# Altium schematic sheet S7CAS-PLEIADES-CARTE-MERE_P20_Motor.SchDoc
size Tabloid; SheetNumber: 19; SheetTotal: 20; Sheet_Name: Motor; Size: 11x17
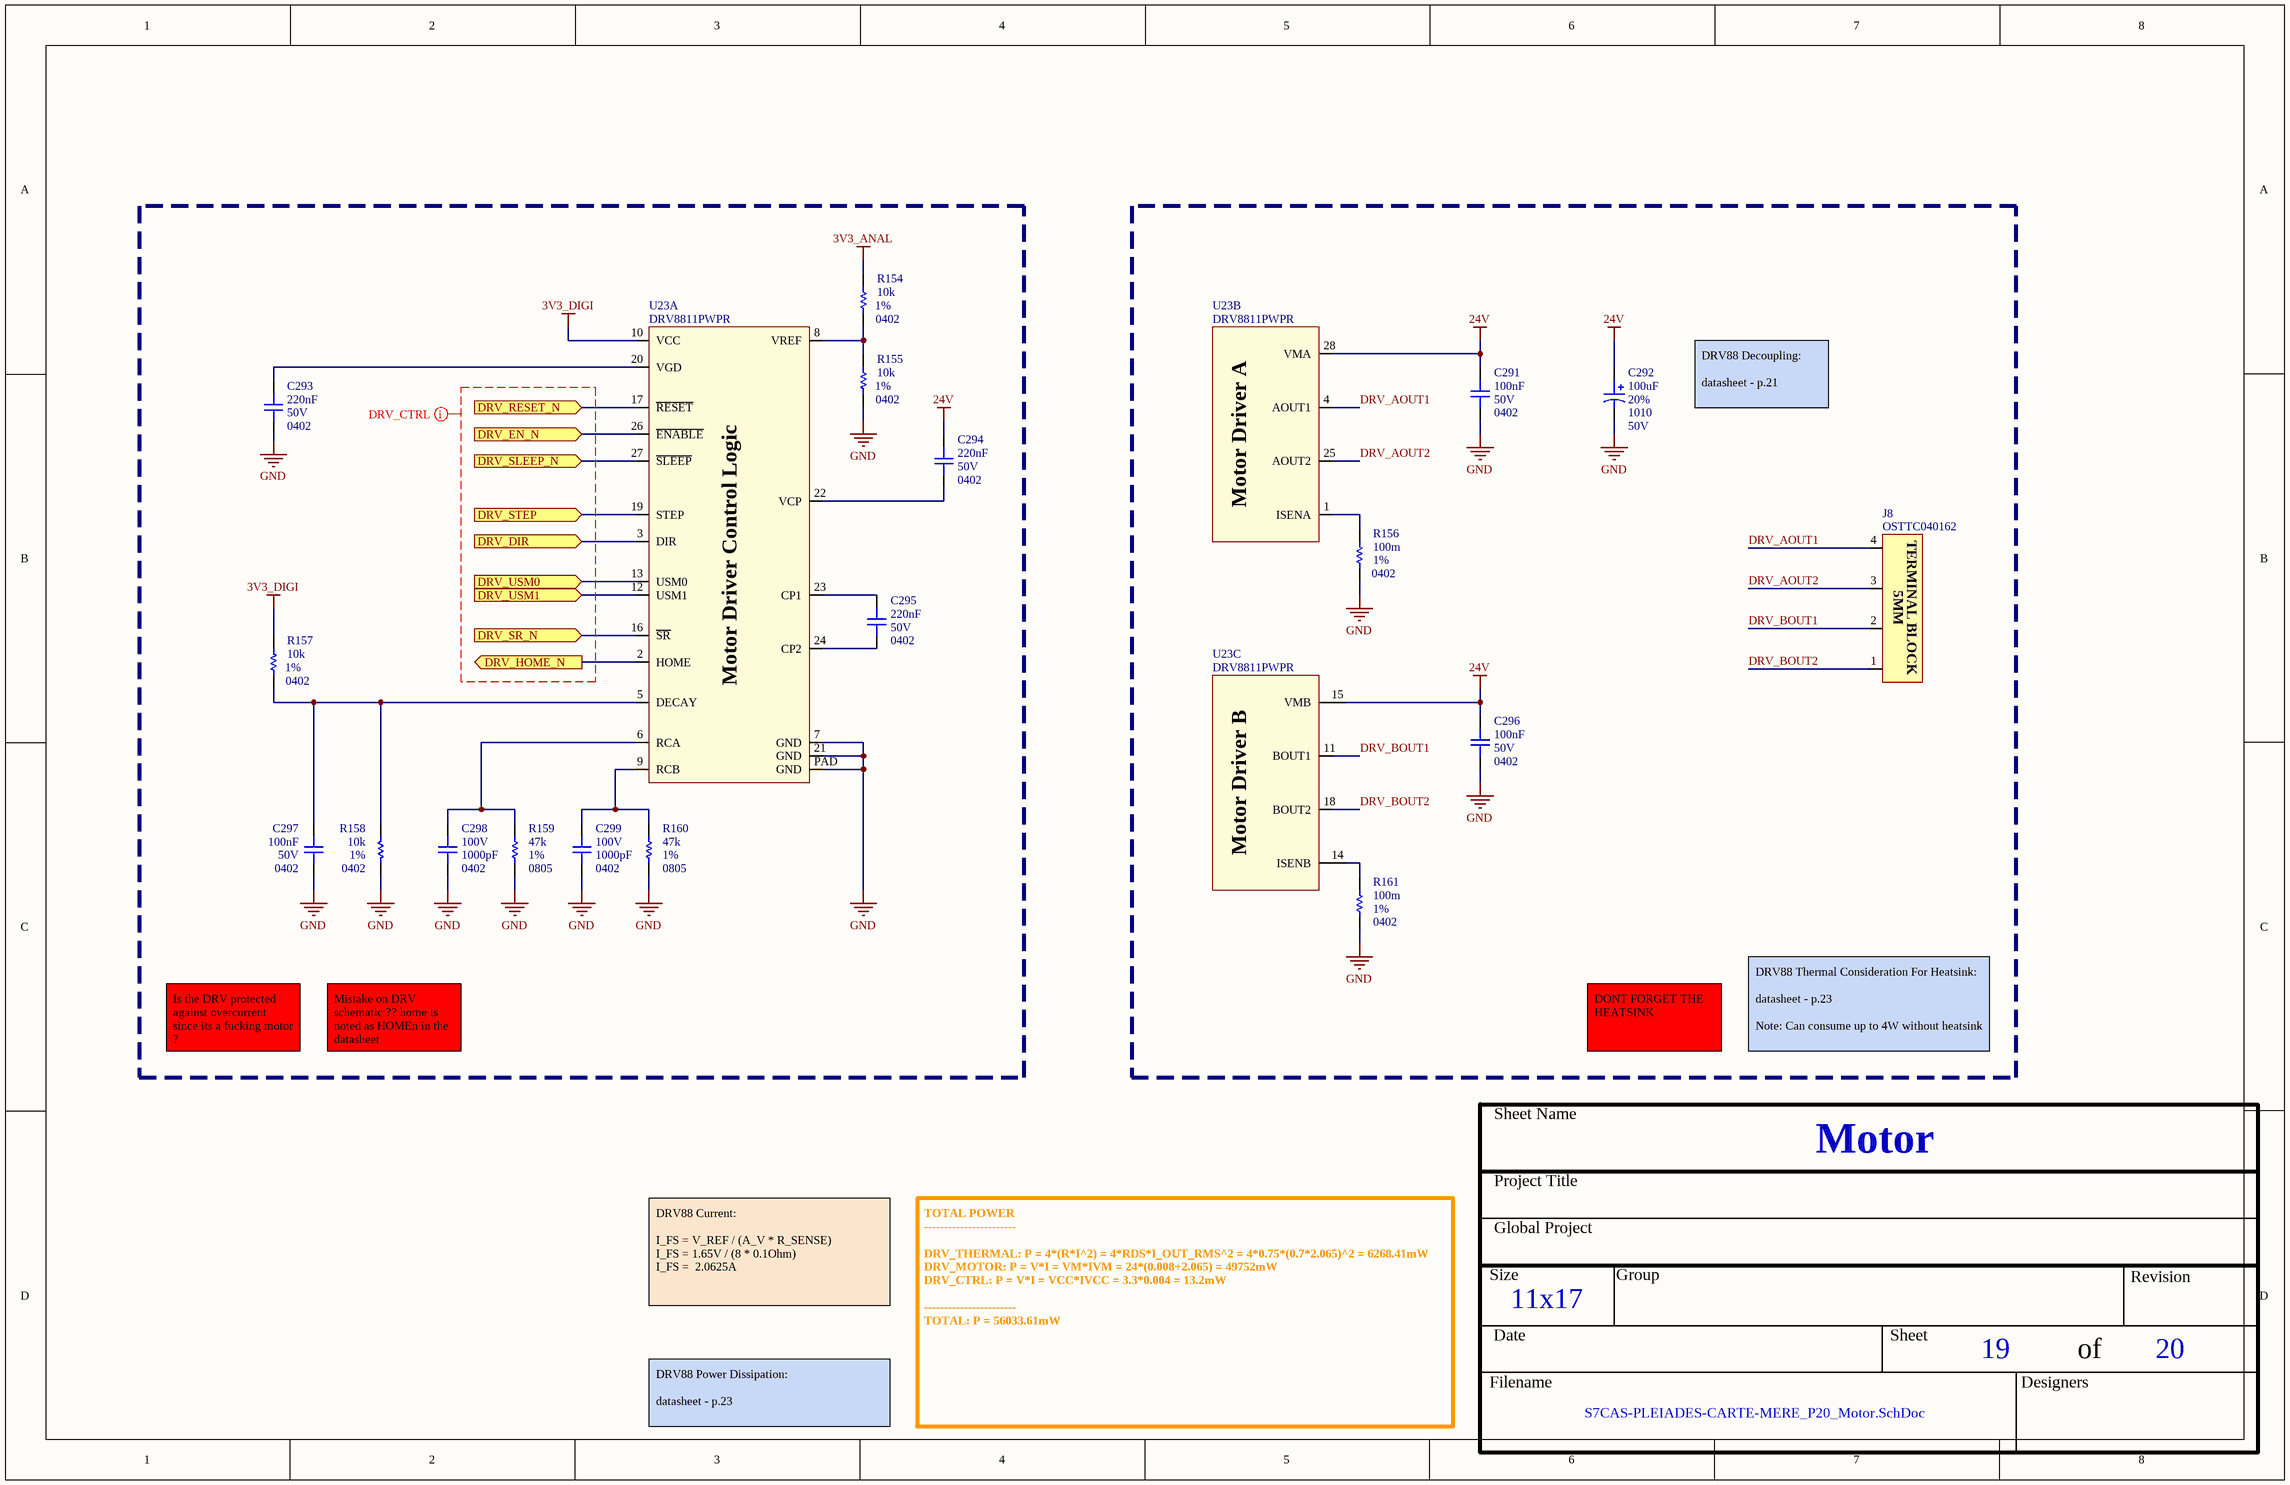
[diagram p0: S7CAS-PLEIADES-CARTE-MERE_P20_Motor.SchDoc]

## Parts
C291  value 100nF  Voltage: 50V  Package: 0402  [CAP_0402]  (hidden comment: CAP - 0402)
C292  value 100uF  Voltage: 50V  Package: 1010  Precision: 20%  [CAP_ALU_1010_vishay]  (hidden comment: MAL215099101E3)
C293  value 220nF  Voltage: 50V  Package: 0402  [CAP_0402]  (hidden comment: CAP - 0402)
C294  value 220nF  Voltage: 50V  Package: 0402  [CAP_0402]  (hidden comment: CAP - 0402)
C295  value 220nF  Voltage: 50V  Package: 0402  [CAP_0402]  (hidden comment: CAP - 0402)
C296  value 100nF  Voltage: 50V  Package: 0402  [CAP_0402]  (hidden comment: CAP - 0402)
C297  value 100nF  Voltage: 50V  Package: 0402  [CAP_0402]  (hidden comment: CAP - 0402)
C298  value 1000pF  Voltage: 100V  Package: 0402  [CAP_0402]  (hidden comment: CAP - 0402)
C299  value 1000pF  Voltage: 100V  Package: 0402  [CAP_0402]  (hidden comment: CAP - 0402)
J8  OSTTC040162  [CONN_TERMINAL_OSTTA040161]
R154  value 10k  Package: 0402  Precision: 1%  [RES_0402]  (hidden comment: RES - 0402)
R155  value 10k  Package: 0402  Precision: 1%  [RES_0402]  (hidden comment: RES - 0402)
R156  value 100m  Package: 0402  Precision: 1%  [RES_0402]  (hidden comment: RES - 0402)
R157  value 10k  Package: 0402  Precision: 1%  [RES_0402]  (hidden comment: RES - 0402)
R158  value 10k  Package: 0402  Precision: 1%  [RES_0402]  (hidden comment: RES - 0402)
R159  value 47k  Package: 0805  Precision: 1%  [RES_0402]  (hidden comment: RES - 0402)
R160  value 47k  Package: 0805  Precision: 1%  [RES_0402]  (hidden comment: RES - 0402)
R161  value 100m  Package: 0402  Precision: 1%  [RES_0402]  (hidden comment: RES - 0402)
U23  DRV8811PWPR  [POW_MOTOR_DRV8811PWPR]  (parts A,B,C of 3)

## Ports
DRV_DIR (in), DRV_EN_N (in), DRV_HOME_N (out), DRV_RESET_N (in), DRV_SLEEP_N (in), DRV_SR_N (in), DRV_STEP (in), DRV_USM0 (in), DRV_USM1 (in)

## Nets
3V3_ANAL: R154.2
3V3_DIGI: R157.2 U23.10(VCC)
24V: C291.2 C292.1 C294.2 C296.2 U23.15(VMB) U23.28(VMA)
GND: C291.1 C292.2 C293.1 C296.1 C297.1 C298.2 C299.2 R155.1 R156.1 R158.1 R159.1 R160.1 R161.1 U23.7(GND) U23.21(GND) U23.PAD(GND)
DRV_AOUT1: J8.4 U23.4(AOUT1)
DRV_AOUT2: J8.3 U23.25(AOUT2)
DRV_BOUT1: J8.2 U23.11(BOUT1)
DRV_BOUT2: J8.1 U23.18(BOUT2)
DRV_DIR: U23.3(DIR) ; port DRV_DIR
DRV_EN_N: U23.26(~{ENABLE}) ; port DRV_EN_N
DRV_HOME_N: U23.2(HOME) ; port DRV_HOME_N
DRV_RESET_N: U23.17(~{RESET}) ; port DRV_RESET_N
DRV_SLEEP_N: U23.27(~{SLEEP}) ; port DRV_SLEEP_N
DRV_SR_N: U23.16(~{SR}) ; port DRV_SR_N
DRV_STEP: U23.19(STEP) ; port DRV_STEP
DRV_USM0: U23.13(USM0) ; port DRV_USM0
DRV_USM1: U23.12(USM1) ; port DRV_USM1
NetC293_2: C293.2 U23.20(VGD)
NetC294_1: C294.1 U23.22(VCP)
NetC295_1: C295.1 U23.24(CP2)
NetC295_2: C295.2 U23.23(CP1)
NetC297_2: C297.2 R157.1 R158.2 U23.5(DECAY)
NetC298_1: C298.1 R159.2 U23.6(RCA)
NetC299_1: C299.1 R160.2 U23.9(RCB)
NetR154_1: R154.1 R155.2 U23.8(VREF)
NetR156_2: R156.2 U23.1(ISENA)
NetR161_2: R161.2 U23.14(ISENB)

## Layout directives
net class TRACKS_50: (no net found under the mark)

## Notes on the sheet
- DRV88 Decoupling:
  datasheet - p.21
- Is the DRV protected against overcurrent since its a fucking motor ?
- Mistake on DRV schematic ?? home is noted as HOMEn in the datasheet
- DONT FORGET THE HEATSINK
- DRV88 Thermal Consideration For Heatsink:
  datasheet - p.23
  Note: Can consume up to 4W without heatsink
- DRV88 Current:
  I_FS = V_REF / (A_V * R_SENSE)
  I_FS = 1.65V / (8 * 0.1Ohm)
  I_FS =  2.0625A
- DRV88 Power Dissipation:
  datasheet - p.23
- TOTAL POWER
  -----------------------
  DRV_THERMAL: P = 4*(R*I^2) = 4*RDS*I_OUT_RMS^2 = 4*0.75*(0.7*2.065)^2 = 6268.41mW
  DRV_MOTOR: P = V*I = VM*IVM = 24*(0.008+2.065) = 49752mW
  DRV_CTRL: P = V*I = VCC*IVCC = 3.3*0.004 = 13.2mW
  -----------------------
  TOTAL: P = 56033.61mW
- Sheet Name
- Project Title
- Global Project
- Size
- Group
- Revision
- Date
- Sheet
- of
- Filename
- Designers
- (in symbol CONN_TERMINAL_OSTTC040162) 5MM; TERMINAL BLOCK
- (in symbol POW_MOTOR_DRV8811PWPR, part A) Motor Driver Control Logic
- (in symbol POW_MOTOR_DRV8811PWPR, part B) Motor Driver A
- (in symbol POW_MOTOR_DRV8811PWPR, part C) Motor Driver B

## Library data of the parts
C291 C296 C297 = CAP - 0402: Mfg Part Number: GRM155R61H104KE14; Precision: 10%; Current: *; CreatedBy: Jonathan Bouchard; Power: *
C292 = CAP_ALU_MAL215099101E3: CAP - ALU 100uF 20% 50V - 1010; Current: 490mA; Mfg: Vishay Dale; Mfg Part Number: MAL215099101E3; HelpURL: http://www.vishay.com/docs/28395/150crz.pdf; CreatedBy: Jonathan Bouchard; Temperature: -55°C to 125°C; Power: *; Supplier 1: Digikey; Supplier Part Number 1: 4399PHDKR-ND
C293-C295 = CAP - 0402: Mfg Part Number: GRM155R61H224KE01; Precision: 10%; Current: *; CreatedBy: Jonathan Bouchard; Power: *
C298 C299 = CAP - 0402: Mfg Part Number: GRM155R72A102KA01; Precision: 10%; Current: *; CreatedBy: Jonathan Bouchard; Power: *
J8 = CONN_TERMINAL_OSTTC040162: CONN -  TERMINAL BLOCK 4POS 5MM - TH; Mfg: On Shore Technology Inc.; Voltage: *; Current: *; Power: *; Mfg Part Number: OSTTC040162; HelpURL: http://www.on-shore.com/wp-content/uploads/2015/09/osttcxx0162.pdf; CreatedBy: Jonathan Bouchard; Temperature: -30°C ~ 105°C; Value: *; Precision: *; Package: TH-4; Supplier 1: Digikey; Supplier Part Number 1: ED2602-ND
R154 R155 R157 R158 = RES - 0402: Mfg Part Number: MCS04020C1002FE000; Voltage: 50V; Power: 1/2W; Current: *; CreatedBy: Jonathan Bouchard
R156 R161 = RES - 0402: Mfg Part Number: ERJ-2BWFR100X; Voltage: 50V; Power: 1/2W; Current: *; CreatedBy: Jonathan Bouchard
R159 R160 = RES - 0402: Mfg Part Number: CRCW080547K0FKECHP; Voltage: 50V; Power: 1/2W; Current: *; CreatedBy: Jonathan Bouchard
U23 = POW_MOTOR_DRV8811PWPR: POW - STEPPER MOTOR DRIVER - SOP-28; Voltage: 3 V ~ 5.5 V / 8 V ~ 38 V; Mfg: Texas Instrument; Current: *; Power: *; Mfg Part Number: DRV8811PWPR; HelpURL: http://www.ti.com/lit/ds/symlink/drv8811.pdf; CreatedBy: Jonathan Bouchard; Temperature: -40°C ~ 150°C (TJ); Value: *; Precision: *; Package: SOP-28; Supplier 1: Digikey; Supplier Part Number 1: 296-24591-1-ND